# Altium schematic sheet 红外板原理图.SchDoc
size A4
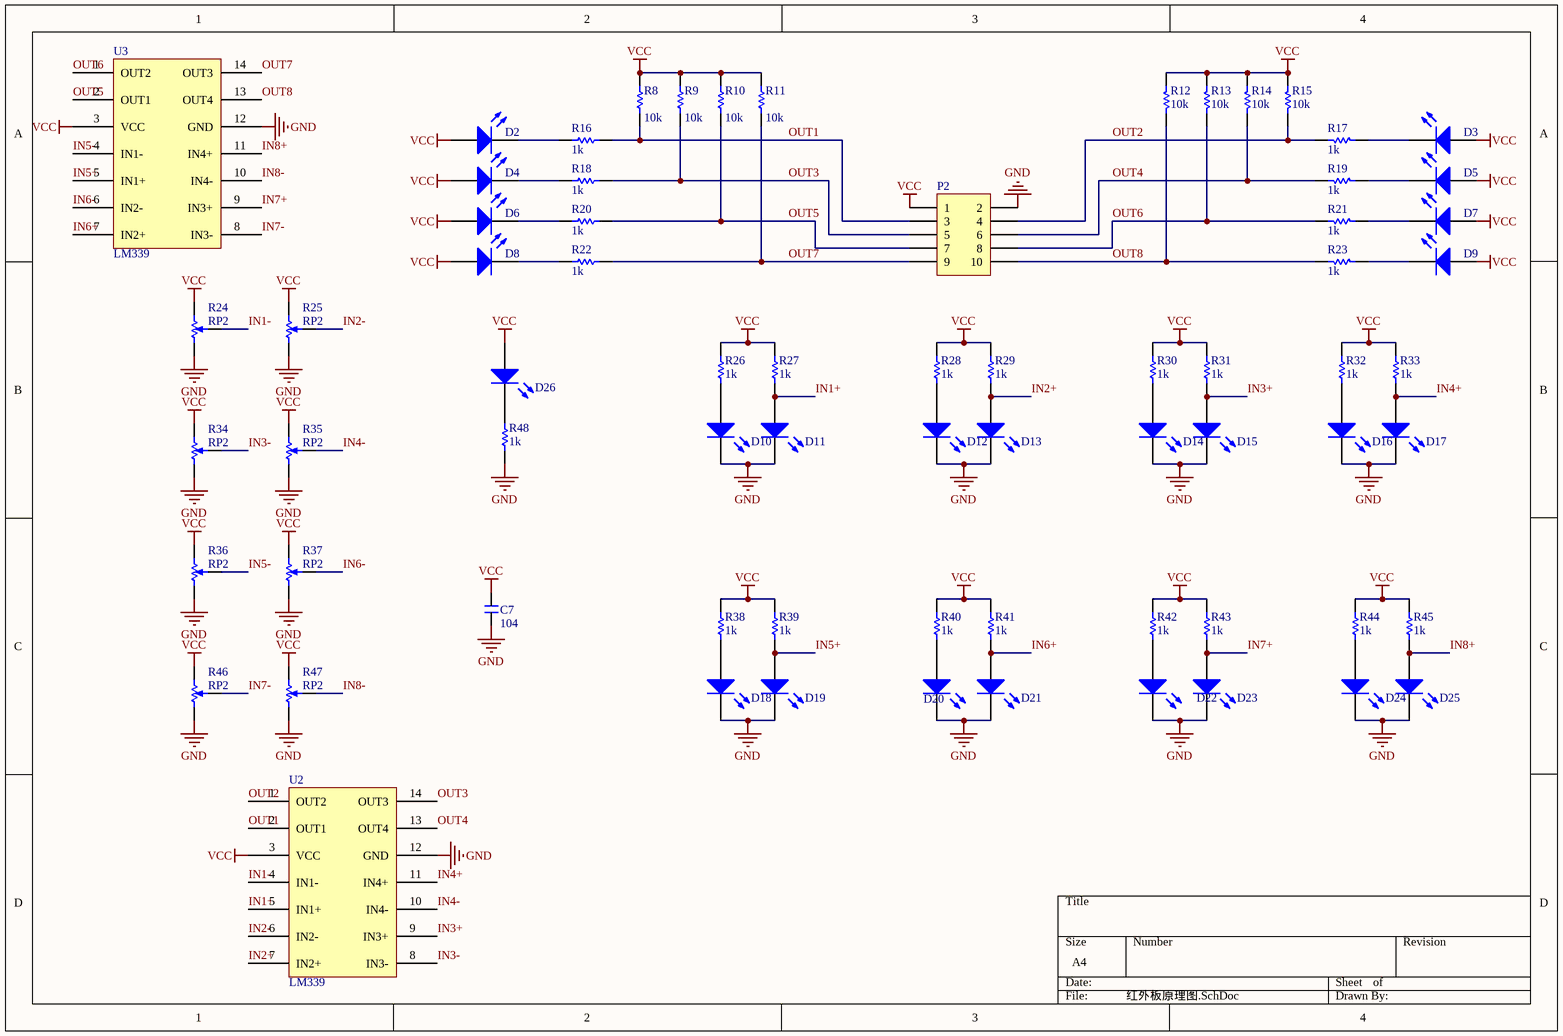
[diagram p0: 红外板原理图.SchDoc]

## Parts
C7  CAP  [RAD-0.1]  (value not drawn)
D2  LED4  [LED1]  (value not drawn)
D3  LED4  [LED1]  (value not drawn)
D4  LED4  [LED1]  (value not drawn)
D5  LED4  [LED1]  (value not drawn)
D6  LED4  [LED1]  (value not drawn)
D7  LED4  [LED1]  (value not drawn)
D8  LED4  [LED1]  (value not drawn)
D9  LED4  [LED1]  (value not drawn)
D10  LED4  [LED1]  (value not drawn)
D11  LED4  [LED1]  (value not drawn)
D12  LED4  [LED1]  (value not drawn)
D13  LED4  [LED1]  (value not drawn)
D14  LED4  [LED1]  (value not drawn)
D15  LED4  [LED1]  (value not drawn)
D16  LED4  [LED1]  (value not drawn)
D17  LED4  [LED1]  (value not drawn)
D18  LED4  [LED1]  (value not drawn)
D19  LED4  [LED1]  (value not drawn)
D20  LED4  [LED1]  (value not drawn)
D21  LED4  [LED1]  (value not drawn)
D22  LED4  [LED1]  (value not drawn)
D23  LED4  [LED1]  (value not drawn)
D24  LED4  [LED1]  (value not drawn)
D25  LED4  [LED1]  (value not drawn)
D26  LED4  [LED1]  (value not drawn)
P2  Header 5X2  [HDR2X5]  (value not drawn)
R8  value 10k  [AXIAL-0.4]  (hidden comment: Res1)
R9  value 10k  [AXIAL-0.4]  (hidden comment: Res1)
R10  value 10k  [AXIAL-0.4]  (hidden comment: Res1)
R11  value 10k  [AXIAL-0.4]  (hidden comment: Res1)
R12  value 10k  [AXIAL-0.4]  (hidden comment: Res1)
R13  value 10k  [AXIAL-0.4]  (hidden comment: Res1)
R14  value 10k  [AXIAL-0.4]  (hidden comment: Res1)
R15  value 10k  [AXIAL-0.4]  (hidden comment: Res1)
R16  value 1k  [AXIAL-0.4]  (hidden comment: Res1)
R17  value 1k  [AXIAL-0.4]  (hidden comment: Res1)
R18  value 1k  [AXIAL-0.4]  (hidden comment: Res1)
R19  value 1k  [AXIAL-0.4]  (hidden comment: Res1)
R20  value 1k  [AXIAL-0.4]  (hidden comment: Res1)
R21  value 1k  [AXIAL-0.4]  (hidden comment: Res1)
R22  value 1k  [AXIAL-0.4]  (hidden comment: Res1)
R23  value 1k  [AXIAL-0.4]  (hidden comment: Res1)
R24  RP2  [POT SMALL]
R25  RP2  [POT SMALL]
R26  value 1k  [AXIAL-0.4]  (hidden comment: Res1)
R27  value 1k  [AXIAL-0.4]  (hidden comment: Res1)
R28  value 1k  [AXIAL-0.4]  (hidden comment: Res1)
R29  value 1k  [AXIAL-0.4]  (hidden comment: Res1)
R30  value 1k  [AXIAL-0.4]  (hidden comment: Res1)
R31  value 1k  [AXIAL-0.4]  (hidden comment: Res1)
R32  value 1k  [AXIAL-0.4]  (hidden comment: Res1)
R33  value 1k  [AXIAL-0.4]  (hidden comment: Res1)
R34  RP2  [POT SMALL]
R35  RP2  [POT SMALL]
R36  RP2  [POT SMALL]
R37  RP2  [POT SMALL]
R38  value 1k  [AXIAL-0.4]  (hidden comment: Res1)
R39  value 1k  [AXIAL-0.4]  (hidden comment: Res1)
R40  value 1k  [AXIAL-0.4]  (hidden comment: Res1)
R41  value 1k  [AXIAL-0.4]  (hidden comment: Res1)
R42  value 1k  [AXIAL-0.4]  (hidden comment: Res1)
R43  value 1k  [AXIAL-0.4]  (hidden comment: Res1)
R44  value 1k  [AXIAL-0.4]  (hidden comment: Res1)
R45  value 1k  [AXIAL-0.4]  (hidden comment: Res1)
R46  RP2  [POT SMALL]
R47  RP2  [POT SMALL]
R48  value 1k  [AXIAL-0.4]  (hidden comment: Res1)
U2  LM339
U3  LM339

## Nets
GND: C7.2 D10.2(K) D11.2(K) D12.2(K) D13.2(K) D14.2(K) D15.2(K) D16.2(K) D17.2(K) D18.2(K) D19.2(K) D20.2(K) D21.2(K) D22.2(K) D23.2(K) D24.2(K) D25.2(K) P2.2 R24.CCW(-) R25.CCW(-) R34.CCW(-) R35.CCW(-) R36.CCW(-) R37.CCW(-) R46.CCW(-) R47.CCW(-) R48.2 U2.12(GND) U3.12(GND)
VCC: C7.1 D2.1(A) D3.1(A) D4.1(A) D5.1(A) D6.1(A) D7.1(A) D8.1(A) D9.1(A) D26.1(A) P2.1 R8.2 R9.2 R10.2 R11.2 R12.2 R13.2 R14.2 R15.2 R24.CW(+) R25.CW(+) R26.1 R27.1 R28.1 R29.1 R30.1 R31.1 R32.1 R33.1 R34.CW(+) R35.CW(+) R36.CW(+) R37.CW(+) R38.1 R39.1 R40.1 R41.1 R42.1 R43.1 R44.1 R45.1 R46.CW(+) R47.CW(+) U2.3(VCC) U3.3(VCC)
IN1+: D11.1(A) R27.2 U2.5(IN1+)
IN1-: R24.W U2.4(IN1-)
IN2+: D13.1(A) R29.2 U2.7(IN2+)
IN2-: R25.W U2.6(IN2-)
IN3+: D15.1(A) R31.2 U2.9(IN3+)
IN3-: R34.W U2.8(IN3-)
IN4+: D17.1(A) R33.2 U2.11(IN4+)
IN4-: R35.W U2.10(IN4-)
IN5+: D19.1(A) R39.2 U3.5(IN1+)
IN5-: R36.W U3.4(IN1-)
IN6+: D21.1(A) R41.2 U3.7(IN2+)
IN6-: R37.W U3.6(IN2-)
IN7+: D23.1(A) R43.2 U3.9(IN3+)
IN7-: R46.W U3.8(IN3-)
IN8+: D25.1(A) R45.2 U3.11(IN4+)
IN8-: R47.W U3.10(IN4-)
OUT1: P2.3 R8.1 R16.1 U2.2(OUT1)
OUT2: P2.4 R15.1 R17.1 U2.1(OUT2)
OUT3: P2.5 R9.1 R18.1 U2.14(OUT3)
OUT4: P2.6 R14.1 R19.1 U2.13(OUT4)
OUT5: P2.7 R10.1 R20.1 U3.2(OUT1)
OUT6: P2.8 R13.1 R21.1 U3.1(OUT2)
OUT7: P2.9 R11.1 R22.1 U3.14(OUT3)
OUT8: P2.10 R12.1 R23.1 U3.13(OUT4)
NetD2_2: D2.2(K) R16.2
NetD3_2: D3.2(K) R17.2
NetD4_2: D4.2(K) R18.2
NetD5_2: D5.2(K) R19.2
NetD6_2: D6.2(K) R20.2
NetD7_2: D7.2(K) R21.2
NetD8_2: D8.2(K) R22.2
NetD9_2: D9.2(K) R23.2
NetD10_1: D10.1(A) R26.2
NetD12_1: D12.1(A) R28.2
NetD14_1: D14.1(A) R30.2
NetD16_1: D16.1(A) R32.2
NetD18_1: D18.1(A) R38.2
NetD20_1: D20.1(A) R40.2
NetD22_1: D22.1(A) R42.2
NetD24_1: D24.1(A) R44.2
NetD26_2: D26.2(K) R48.1

## Notes on the sheet
- (in symbol CAP) 104

## Library data of the parts
C7 = CAP: 无极性
D2-D26 = LED4: 0603
P2 = Header 5X2: Header, 5-Pin, Dual row; LatestRevisionDate: 17-Jul-2002; LatestRevisionNote: Re-released for DXP Platform.; Publisher: Altium Limited
R8-R23 R26-R33 R38-R45 R48 = Res1: Resistor; Published: 8-Jun-2000; LatestRevisionDate: 17-Jul-2002; LatestRevisionNote: Re-released for DXP Platform.; PackageReference: AXIAL-0.3; Publisher: Altium Limited; PackageDescription: Axial Device, Thru-Hole; 2 Leads; 0.3 in Pin Spacing
R24 R25 R34-R37 R46 R47 = RPot SM: Square Trimming Potentiometer; pin to pad: CCW>3 CW>2 W>1; Published: 17-Dec-2003; DatasheetVersion: Oct-2003; PackageReference: POT4MM-2; Publisher: Altium Limited; PackageDescription: Square Trimming Potentiometer; ComponentLink1Description: Manufacturer Link; ComponentLink1URL: http://bourns.com/2/search.html